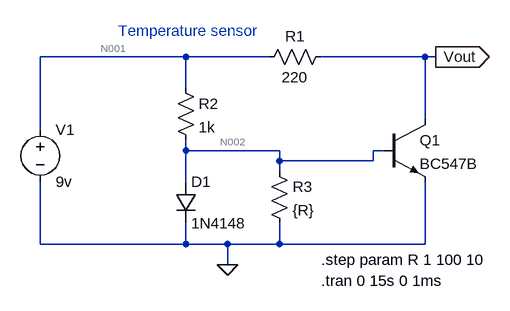
[diagram p0: schematic Temperarure sensor.asc]
Temperarure sensor.asc, the LTspice schematic file:
Version 4
SHEET 1 880 680
WIRE 96 48 -128 48
WIRE 224 48 96 48
WIRE 464 48 304 48
WIRE 480 48 464 48
WIRE 96 96 96 48
WIRE 464 144 464 48
WIRE -128 160 -128 48
WIRE 96 192 96 176
WIRE 240 192 96 192
WIRE 400 192 384 192
WIRE 240 208 240 192
WIRE 384 208 384 192
WIRE 384 208 240 208
WIRE 240 224 240 208
WIRE 96 240 96 192
WIRE -128 336 -128 240
WIRE 96 336 96 304
WIRE 96 336 -128 336
WIRE 160 336 96 336
WIRE 240 336 240 304
WIRE 240 336 160 336
WIRE 464 336 464 240
WIRE 464 336 240 336
WIRE 160 368 160 336
FLAG 160 368 0
FLAG 480 48 Vout
IOPIN 480 48 Out
SYMBOL voltage -128 144 R0
SYMATTR InstName V1
SYMATTR Value 9v
SYMBOL res 320 32 R90
WINDOW 0 0 56 VBottom 2
WINDOW 3 32 56 VTop 2
SYMATTR InstName R1
SYMATTR Value 220
SYMBOL res 80 80 R0
SYMATTR InstName R2
SYMATTR Value 1k
SYMBOL res 224 208 R0
SYMATTR InstName R3
SYMATTR Value {R}
SYMBOL diode 80 240 R0
SYMATTR InstName D1
SYMATTR Value 1N4148
SYMBOL npn 400 144 R0
SYMATTR InstName Q1
SYMATTR Value BC547B
TEXT -8 8 Left 2 ;Temperature sensor
TEXT 304 360 Left 2 !.step param R 1 100 10
TEXT 304 392 Left 2 !.tran 0 15s 0 1ms

The netlist it stands for:
* Temperarure sensor.asc
V1 N001 0 9v
R1 Vout N001 220
R2 N001 N002 1k
R3 N002 0 {R}
D1 N002 0 1N4148
Q1 Vout N002 0 0 BC547B
.model D D
.lib standard.dio
.model NPN NPN
.model PNP PNP
.lib standard.bjt
* Temperature sensor
.step param R 1 100 10
.tran 0 15s 0 1ms
.backanno
.end

* Results of the author's LTspice run, read from the files saved beside the schematic
* Operating Point (first step), zero values left out:
*   r = 1 
*   V(n001) = 9 V
*   V(vout) = 9 V
*   V(n002) = 8.991 mV
*   Ic(Q1) = 9.095 pA
*   Ib(Q1) = -9.047 pA
*   I(D1) = 553.1 pA
*   I(R3) = 8.991 mA
*   I(R2) = 8.991 mA
*   I(R1) = -9.096 pA
*   I(V1) = -8.991 mA
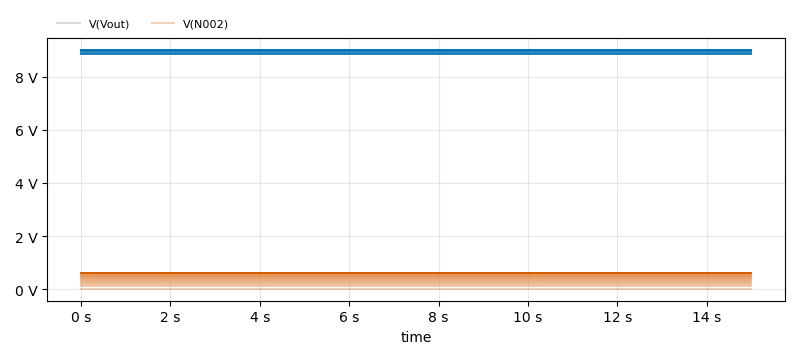
[diagram p1: Transient Analysis of Temperarure sensor.asc, plotted from the saved traces]
* Transient Analysis, 11 runs:
*   V(Vout) [r=1]: min 9 V, max 9 V, average 9 V, rms 9 V, last 9 V
*   V(Vout) [r=11]: min 9 V, max 9 V, average 9 V, rms 9 V, last 9 V
*   V(Vout) [r=21]: min 9 V, max 9 V, average 9 V, rms 9 V, last 9 V
*   V(Vout) [r=31]: min 9 V, max 9 V, average 9 V, rms 9 V, last 9 V
*   V(Vout) [r=41]: min 9 V, max 9 V, average 9 V, rms 9 V, last 9 V
*   V(Vout) [r=51]: min 9 V, max 9 V, average 9 V, rms 9 V, last 9 V
*   V(Vout) [r=61]: min 8.998 V, max 8.998 V, average 8.998 V, rms 8.998 V, last 8.998 V
*   V(Vout) [r=71]: min 8.988 V, max 8.988 V, average 8.988 V, rms 8.988 V, last 8.988 V
*   V(N002) [r=1]: min 8.991 mV, max 8.991 mV, average 8.991 mV, rms 8.991 mV, last 8.991 mV
*   V(N002) [r=11]: min 97.92 mV, max 97.92 mV, average 97.92 mV, rms 97.92 mV, last 97.92 mV
*   V(N002) [r=21]: min 185.1 mV, max 185.1 mV, average 185.1 mV, rms 185.1 mV, last 185.1 mV
*   V(N002) [r=31]: min 270.6 mV, max 270.6 mV, average 270.6 mV, rms 270.6 mV, last 270.6 mV
*   V(N002) [r=41]: min 354.2 mV, max 354.2 mV, average 354.2 mV, rms 354.2 mV, last 354.2 mV
*   V(N002) [r=51]: min 434.9 mV, max 434.9 mV, average 434.9 mV, rms 434.9 mV, last 434.9 mV
*   V(N002) [r=61]: min 507 mV, max 507 mV, average 507 mV, rms 507 mV, last 507 mV
*   V(N002) [r=71]: min 558.9 mV, max 558.9 mV, average 558.9 mV, rms 558.9 mV, last 558.9 mV